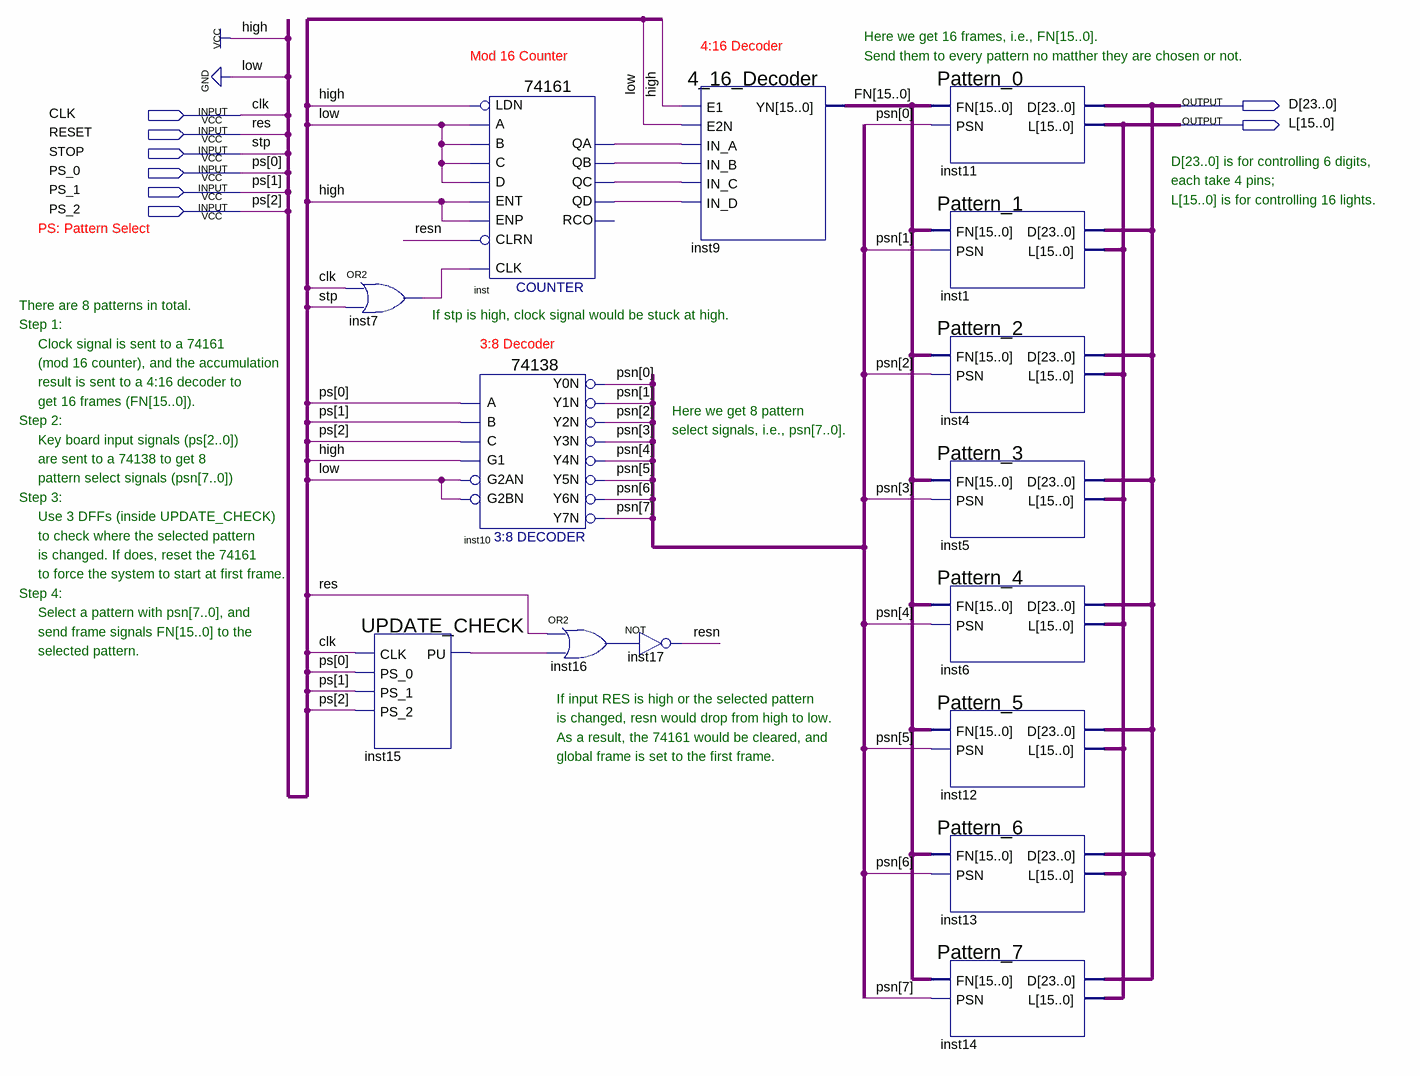
[diagram p0: schematic sheet]
// Quartus schematic Ad_Board_Controller.bdf as structural Verilog: 15 symbols, 8 pins
module Ad_Board_Controller (
  input  CLK,
  input  RESET,
  input  STOP,
  input  PS_0,
  input  PS_1,
  input  PS_2,
  output [23:0] D,
  output [15:0] L
);

  wire inst7_out, inst15_pu, inst16_out, inst_qa, inst_qb, inst_qc, inst_qd, resn;
  wire [7:0] psn;
  wire [15:0] FN;

  or inst7 (inst7_out, CLK, STOP);
  UPDATE_CHECK inst15 (.CLK(CLK), .PS_0(PS_0), .PS_1(PS_1), .PS_2(PS_2), .PU(inst15_pu));
  \74161  inst (
    .CLRN(resn), .CLK(inst7_out), .ENP(1'b1), .LDN(1'b1), .A(1'b0), .D(1'b0), .ENT(1'b1), .B(1'b0), .C(1'b0),
    .QD(inst_qd), .QC(inst_qc), .QB(inst_qb), .QA(inst_qa));  // open: RCO
  \74138  inst10 (
    .A(PS_0), .B(PS_1), .G1(1'b1), .C(PS_2), .G2AN(1'b0), .G2BN(1'b0), .Y0N(psn[0]), .Y1N(psn[1]),
    .Y2N(psn[2]), .Y3N(psn[3]), .Y4N(psn[4]), .Y5N(psn[5]), .Y6N(psn[6]), .Y7N(psn[7]));
  or inst16 (inst16_out, RESET, inst15_pu);
  not inst17 (resn, inst16_out);
  \4_16_Decoder  inst9 (.E1(1'b1), .E2N(1'b0), .IN_A(inst_qa), .IN_B(inst_qb), .IN_C(inst_qc), .IN_D(inst_qd), .YN(FN));
  Pattern_0 inst11 (.FN(FN), .PSN(psn[0]), .D(D), .L(L));
  Pattern_1 inst1 (.FN(FN), .PSN(psn[1]), .D(D), .L(L));
  Pattern_2 inst4 (.FN(FN), .PSN(psn[2]), .D(D), .L(L));
  Pattern_3 inst5 (.FN(FN), .PSN(psn[3]), .D(D), .L(L));
  Pattern_4 inst6 (.FN(FN), .PSN(psn[4]), .D(D), .L(L));
  Pattern_5 inst12 (.FN(FN), .PSN(psn[5]), .D(D), .L(L));
  Pattern_6 inst13 (.FN(FN), .PSN(psn[6]), .D(D), .L(L));
  Pattern_7 inst14 (.FN(FN), .PSN(psn[7]), .D(D), .L(L));

  // Other names for the same wires on the sheet: ps[2:0] = {PS_2, PS_1, PS_0}; res = RESET; stp = STOP

  // Notes on the sheet:
  //   Here we get 16 frames, i.e., FN[15..0].
  //   4:16 Decoder
  //   Mod 16 Counter
  //   Send them to every pattern no matther they are chosen or not.
  //   D[23..0] is for controlling 6 digits,
  //   each take 4 pins;
  //   L[15..0] is for controlling 16 lights.
  //   PS: Pattern Select
  //   There are 8 patterns in total.
  //   If stp is high, clock signal would be stuck at high.
  //   Step 1:
  //   Clock signal is sent to a 74161
  //   3:8 Decoder
  //   (mod 16 counter), and the accumulation
  //   result is sent to a 4:16 decoder to
  //   get 16 frames (FN[15..0]).
  //   Here we get 8 pattern
  //   Step 2:
  //   select signals, i.e., psn[7..0].
  //   Key board input signals (ps[2..0])
  //   are sent to a 74138 to get 8
  //   pattern select signals (psn[7..0])
  //   Step 3:
  //   Use 3 DFFs (inside UPDATE_CHECK)
  //   to check where the selected pattern
  //   is changed. If does, reset the 74161
  //   to force the system to start at first frame.
  //   Step 4:
  //   Select a pattern with psn[7..0], and
  //   send frame signals FN[15..0] to the
  //   selected pattern.
  //   If input RES is high or the selected pattern
  //   is changed, resn would drop from high to low.
  //   As a result, the 74161 would be cleared, and
  //   global frame is set to the first frame.
endmodule
